# Altium schematic sheet sanziqi_v1.2.SchDoc
size A2
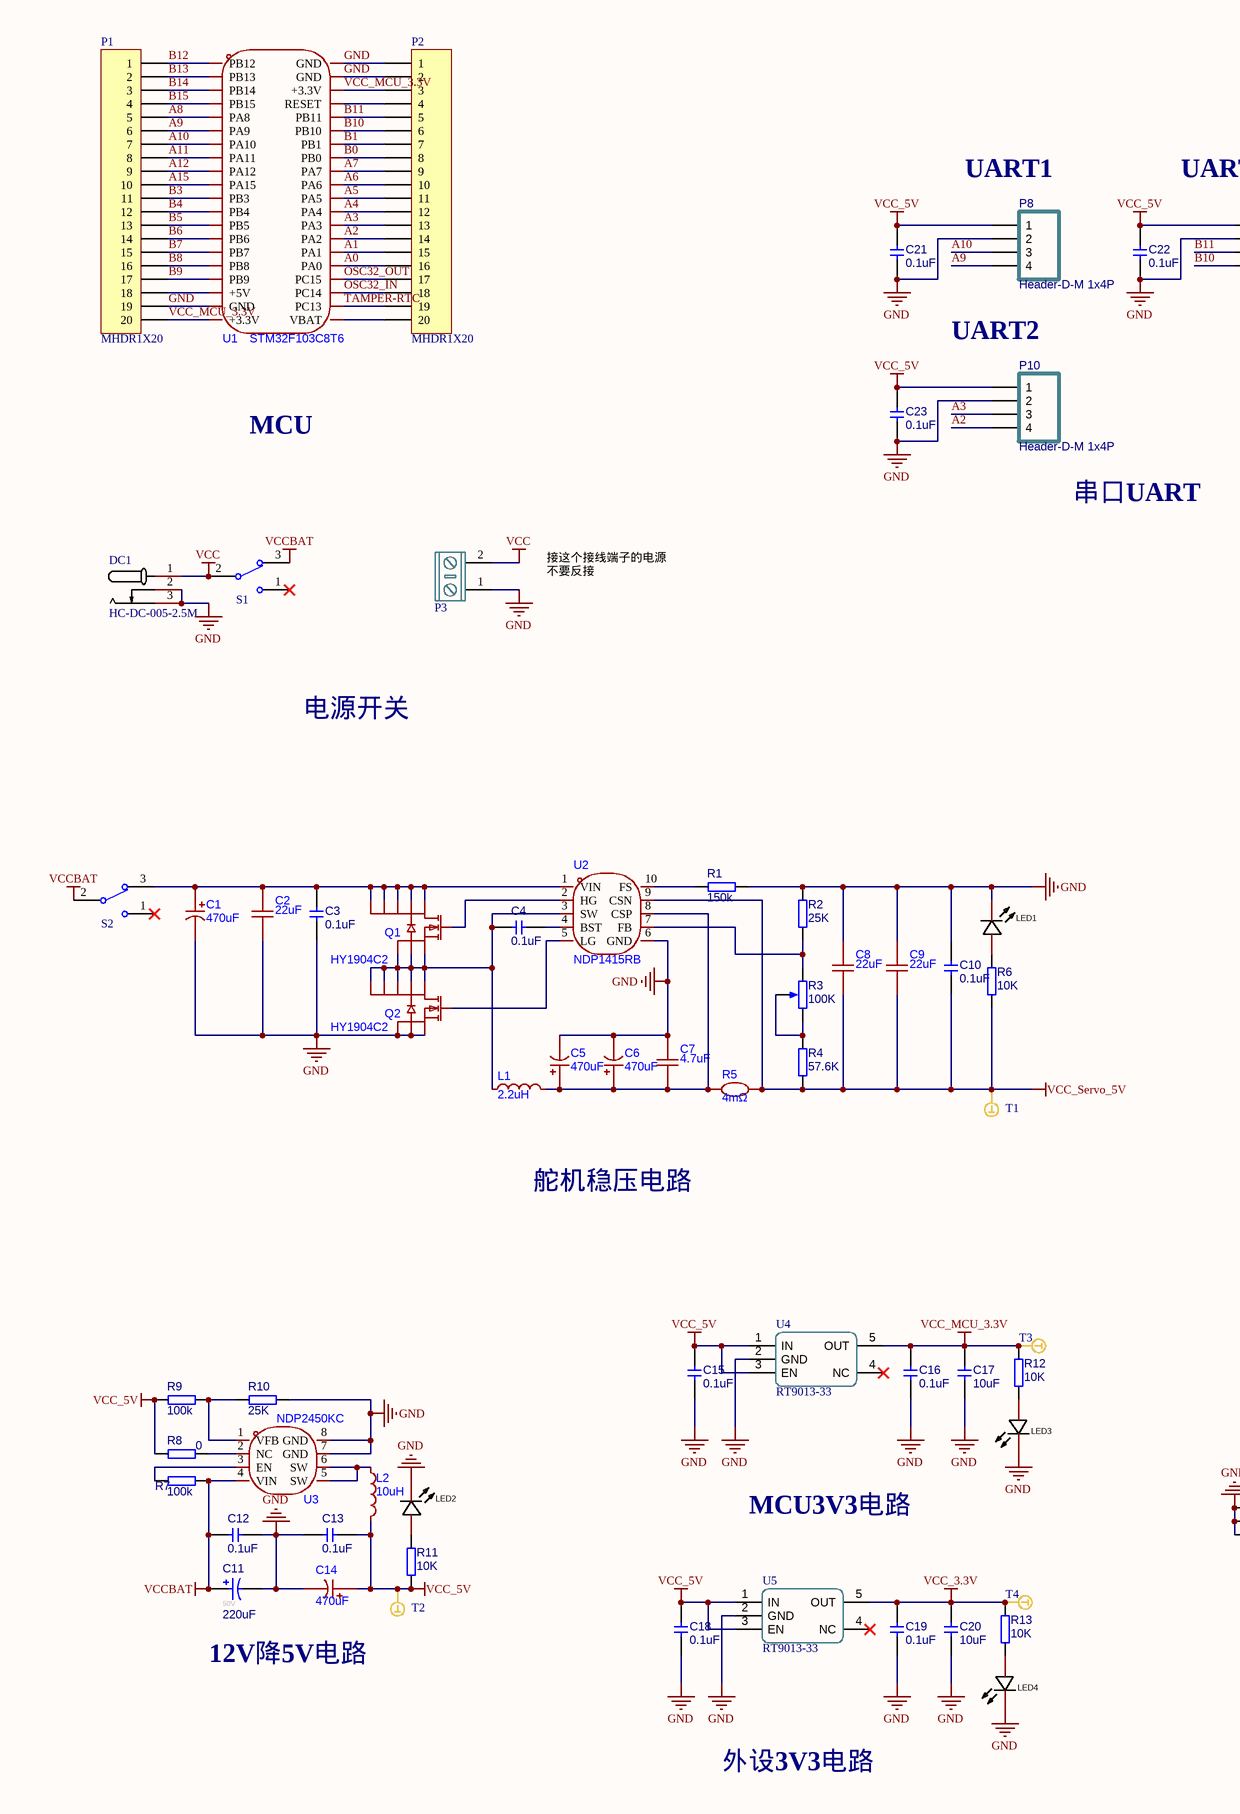
[diagram p0: sanziqi_v1.2.SchDoc, left]
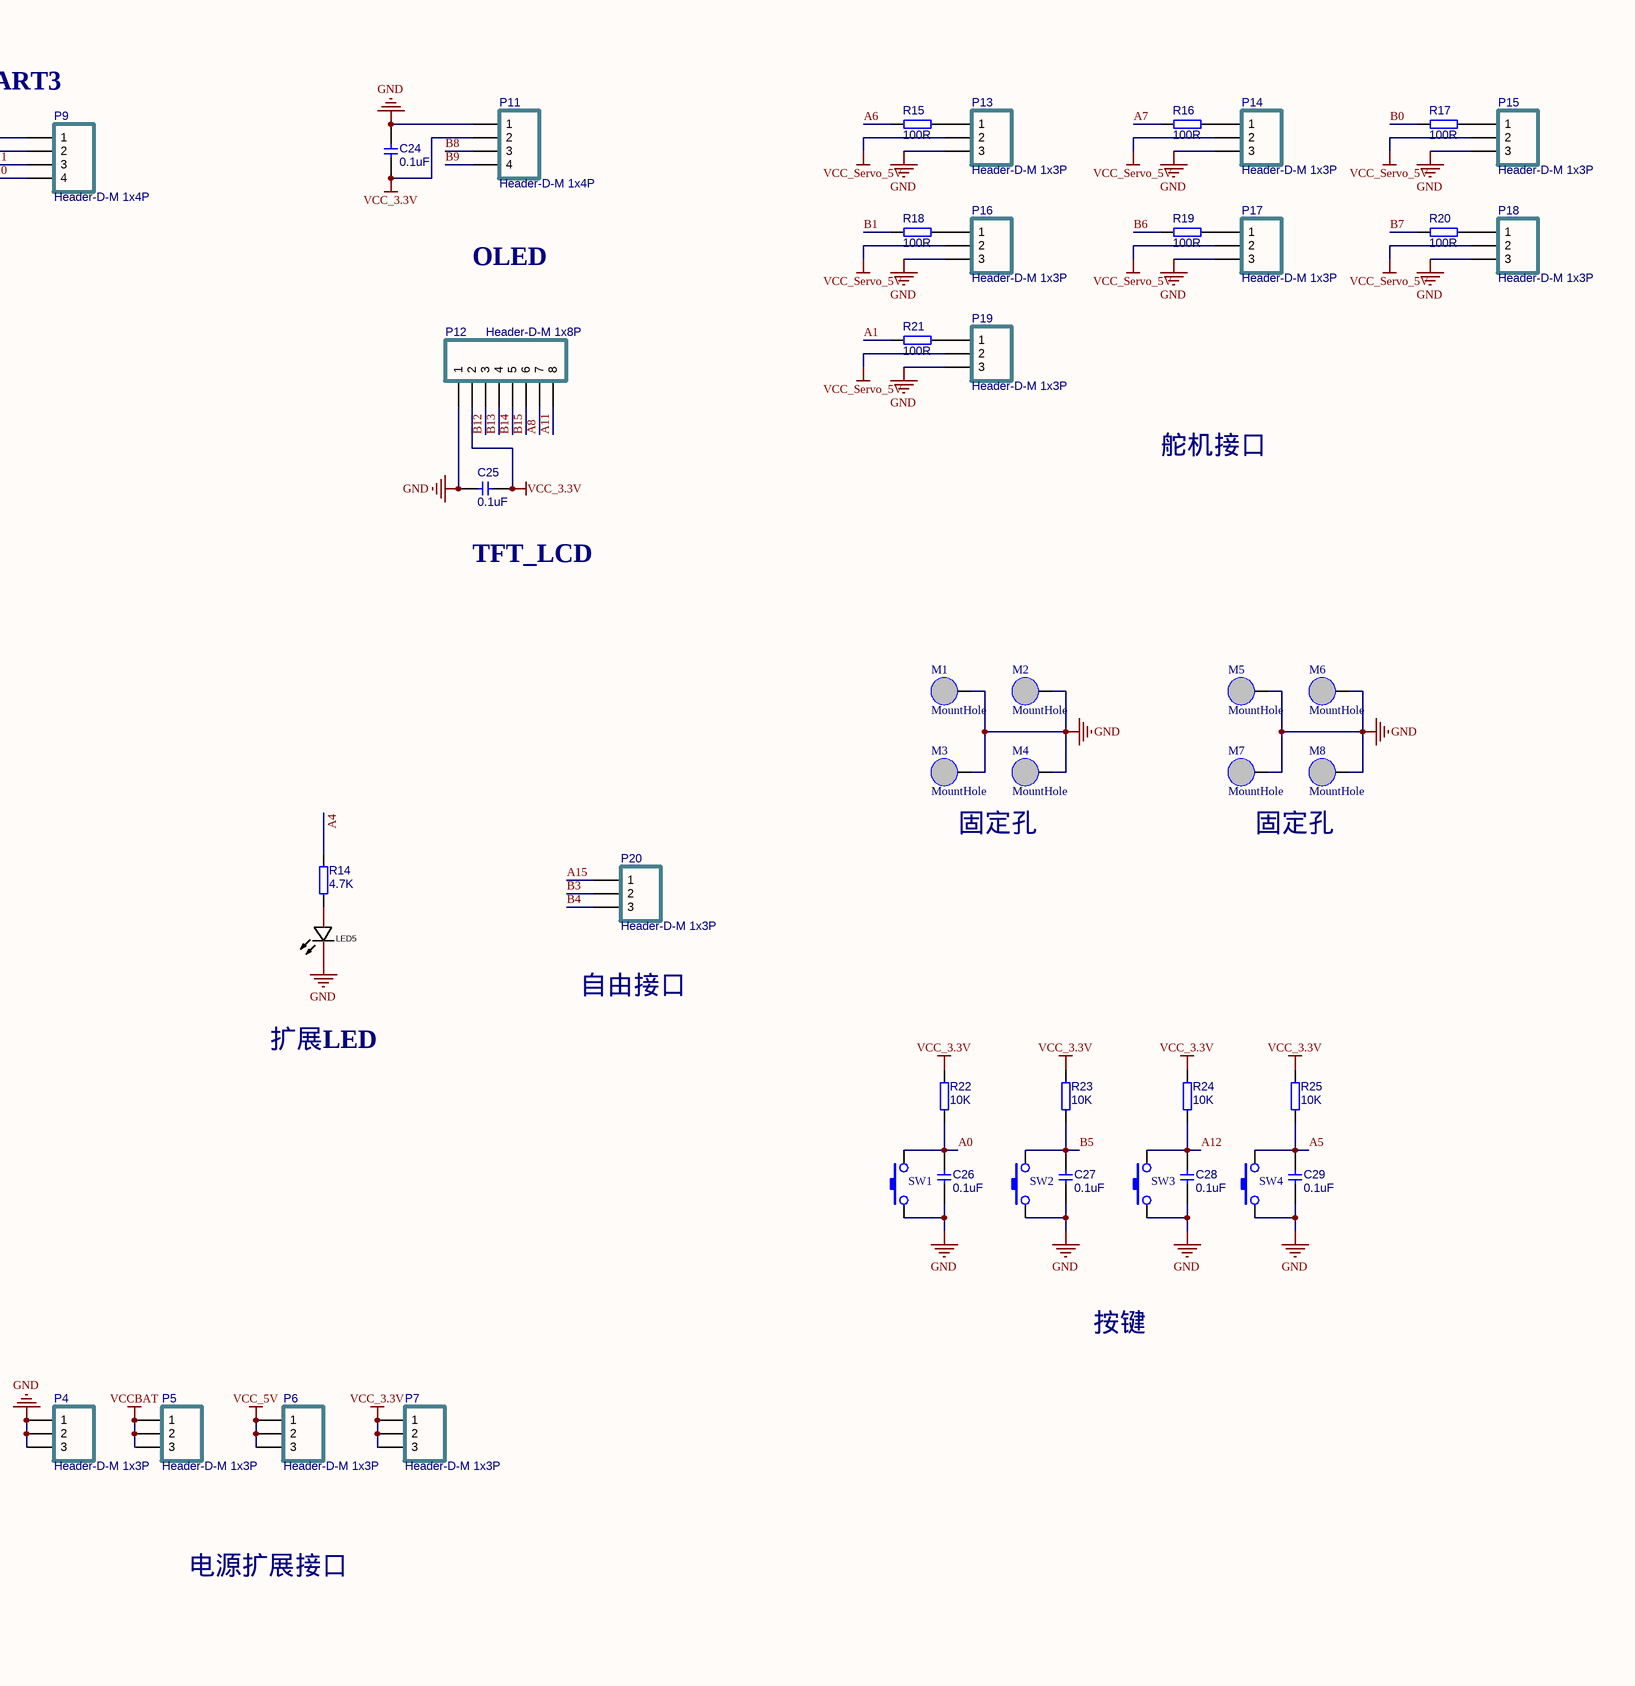
[diagram p1: sanziqi_v1.2.SchDoc, right]

## Parts
C1  470uF  [CAP-TH_BD10.0-P5.00-D0.6-FD]
C2  22uF  [C1206]
C3  value 0.1uF  [C0805]
C4  value 0.1uF  [C0805]
C5  470uF  [CAP-TH_BD10.0-P5.00-D0.6-FD]
C6  470uF  [CAP-TH_BD10.0-P5.00-D0.6-FD]
C7  4.7uF  [C1206]
C8  22uF  [C1206]
C9  22uF  [C1206]
C10  value 0.1uF  [C0805]
C11  value 220uF  Voltage: 50V  [CAP-TH_BD8.0-P3.50-D0.6-FD]  (hidden comment: 220uF 50V 铝电解)
C12  value 0.1uF  [C0805]
C13  value 0.1uF  [C0805]
C14  470uF  [CAP-TH_BD10.0-P5.00-D0.6-FD]
C15  value 0.1uF  [C0805]
C16  value 0.1uF  [C0805]
C17  value 10uF  [C0805]
C18  value 0.1uF  [C0805]
C19  value 0.1uF  [C0805]
C20  value 10uF  [C0805]
C21  value 0.1uF  [C0805]
C22  value 0.1uF  [C0805]
C23  value 0.1uF  [C0805]
C24  value 0.1uF  [C0805]
C25  value 0.1uF  [C0805]
C26  value 0.1uF  [C0805]
C27  value 0.1uF  [C0805]
C28  value 0.1uF  [C0805]
C29  value 0.1uF  [C0805]
DC1  HC-DC-005-2.5M  [DC-005]
L1  2.2uH  [IND-SMD_L11.5-W10.0_FXL1040]
L2  10uH  [IND-SMD_L11.5-W10.0_FXL1040]
LED1  NCD0805R1  [LED0805-R-RD]  (value not drawn)
LED2  NCD0805R1  [LED0805-R-RD]  (value not drawn)
LED3  NCD0805R1  [LED0805-R-RD]  (value not drawn)
LED4  NCD0805R1  [LED0805-R-RD]  (value not drawn)
LED5  NCD0805R1  [LED0805-R-RD]  (value not drawn)
M1  MountHole  [M3-MountHole]  (no BOM)
M2  MountHole  [M3-MountHole]  (no BOM)
M3  MountHole  [M3-MountHole]  (no BOM)
M4  MountHole  [M3-MountHole]  (no BOM)
M5  MountHole  [M3-MountHole]  (no BOM)
M6  MountHole  [M3-MountHole]  (no BOM)
M7  MountHole  [M3-MountHole]  (no BOM)
M8  MountHole  [M3-MountHole]  (no BOM)
P1  MHDR1X20  [HDR2.54-LI-20P]
P2  MHDR1X20  [HDR2.54-LI-20P]
P3  KF/WJ/DG 30x connecter  [KF/WJ/DG 301-2p-5.0mm]  (value not drawn)
P4  Header-D-M 1x3P  [HDR1X3-M]
P5  Header-D-M 1x3P  [HDR1X3-M]
P6  Header-D-M 1x3P  [HDR1X3-M]
P7  Header-D-M 1x3P  [HDR1X3-M]
P8  Header-D-M 1x4P  [HDR1X4-M]
P9  Header-D-M 1x4P  [HDR1X4-M]
P10  Header-D-M 1x4P  [HDR1X4-M]
P11  Header-D-M 1x4P  [HDR1X4-M]
P12  Header-D-M 1x8P  [HDR1X8-M]
P13  Header-D-M 1x3P  [HDR1X3-M]
P14  Header-D-M 1x3P  [HDR1X3-M]
P15  Header-D-M 1x3P  [HDR1X3-M]
P16  Header-D-M 1x3P  [HDR1X3-M]
P17  Header-D-M 1x3P  [HDR1X3-M]
P18  Header-D-M 1x3P  [HDR1X3-M]
P19  Header-D-M 1x3P  [HDR1X3-M]
P20  Header-D-M 1x3P  [HDR1X3-M]
Q1  HY1904C2  [DFN-8_L5.9-W5.2-P1.27-LS6.2-BL]
Q2  HY1904C2  [DFN-8_L5.9-W5.2-P1.27-LS6.2-BL]
R1  value 150k  [R0805]  (hidden comment: 150k ±1%)
R2  value 25K  [R0805]  (hidden comment: 25K ±1%)
R3  100K  [RESPOT3296W]
R4  value 57.6K  [R0805]  (hidden comment: 57.6K ±1%)
R5  4mΩ  [RES-SMD_L6.4-W3.2-R2512]
R6  value 10K  [R0805]  (hidden comment: 10K ±1%)
R7  value 100k  [R0805]  (hidden comment: 100k ±1%)
R8  value 0  [R0805]  (hidden comment: 0 ±1%)
R9  value 100k  [R0805]  (hidden comment: 100k ±1%)
R10  value 25K  [R0805]  (hidden comment: 25K ±1%)
R11  value 10K  [R0805]  (hidden comment: 10K ±1%)
R12  value 10K  [R0805]  (hidden comment: 10K ±1%)
R13  value 10K  [R0805]  (hidden comment: 10K ±1%)
R14  value 4.7K  [R0805]  (hidden comment: 4.7K ±1%)
R15  value 100R  [R0805]  (hidden comment: 100R ±1%)
R16  value 100R  [R0805]  (hidden comment: 100R ±1%)
R17  value 100R  [R0805]  (hidden comment: 100R ±1%)
R18  value 100R  [R0805]  (hidden comment: 100R ±1%)
R19  value 100R  [R0805]  (hidden comment: 100R ±1%)
R20  value 100R  [R0805]  (hidden comment: 100R ±1%)
R21  value 100R  [R0805]  (hidden comment: 100R ±1%)
R22  value 10K  [R0805]  (hidden comment: 10K ±1%)
R23  value 10K  [R0805]  (hidden comment: 10K ±1%)
R24  value 10K  [R0805]  (hidden comment: 10K ±1%)
R25  value 10K  [R0805]  (hidden comment: 10K ±1%)
S1  SW-SPDT  [SS12D10]  (value not drawn)
S2  SW-SPDT  [SS12D10]  (value not drawn)
SW1  SW-PB_V  [TSW SMD-3*6*2.5]  (value not drawn)
SW2  SW-PB_V  [TSW SMD-3*6*2.5]  (value not drawn)
SW3  SW-PB_V  [TSW SMD-3*6*2.5]  (value not drawn)
SW4  SW-PB_V  [TSW SMD-3*6*2.5]  (value not drawn)
T1  Testpoint-Pad  [testpoint-pad-1mm]  (value not drawn)  (no BOM)
T2  Testpoint-Pad  [testpoint-pad-1mm]  (value not drawn)  (no BOM)
T3  Testpoint-Pad  [testpoint-pad-1mm]  (value not drawn)  (no BOM)
T4  Testpoint-Pad  [testpoint-pad-1mm]  (value not drawn)  (no BOM)
U1  STM32F103C8T6  [CONN-TH_L53.3-W22.9_STM32F103C8T6-CARD]
U2  NDP1415RB  [SSOP-10_L4.9-W3.9-P1.00-LS6.0-BL-1]
U3  NDP2450KC  [SOP-8_L4.9-W3.9-P1.27-LS6.0-BL]
U4  RT9013-33  [SOT-23-5]
U5  RT9013-33  [SOT-23-5]

## Nets
GND: C1.2 C2.1 C3.1 C5.2 C6.2 C7.2 C8.2 C9.2 C10.2 C11.2 C12.2 C13.1 C14.2 C15.1 C16.1 C17.1 C18.1 C19.1 C20.1 C21.1 C22.1 C23.1 C24.2 C25.2 C26.1 C27.1 C28.1 C29.1 DC1.2 DC1.3 LED1.2(-) LED2.2(-) LED3.2(-) LED4.2(-) LED5.2(-) M1.1 M2.1 M3.1 M4.1 M5.1 M6.1 M7.1 M8.1 P1.19 P2.1 P2.2 P3.1 P4.1 P4.2 P4.3 P8.2 P9.2 P10.2 P11.1 P12.1 P13.3 P14.3 P15.3 P16.3 P17.3 P18.3 P19.3 Q2.1(S) Q2.2(S) Q2.3(S) R1.2 R2.2 R10.2 SW1.1 SW2.1 SW3.1 SW4.1 U1.19(GND) U1.39(GND) U1.40(GND) U2.6(GND) U3.7(GND) U3.8(GND) U4.2(GND) U5.2(GND)
VCC: DC1.1 P3.2 S1.2
VCC_3.3V: C19.2 C20.2 C24.1 C25.1 P7.1 P7.2 P7.3 P11.2 P12.2 R13.2 R22.2 R23.2 R24.2 R25.2 T4.1(T) U5.5(OUT)
VCC_5V: C13.2 C14.1 C15.2 C18.2 C21.2 C22.2 C23.2 L2.2 P6.1 P6.2 P6.3 P8.1 P9.1 P10.1 R8.1 R9.1 R11.2 T2.1(T) U4.1(IN) U4.3(EN) U5.1(IN) U5.3(EN)
VCC_MCU_3.3V: C16.2 C17.2 P1.20 P2.3 R12.2 T3.1(T) U1.20(+3.3V) U1.38(+3.3V) U4.5(OUT)
VCC_Servo_5V: C8.1 C9.1 C10.1 P13.2 P14.2 P15.2 P16.2 P17.2 P18.2 P19.2 R4.1 R5.2 R6.2 T1.1(T) U2.9(CSN)
VCCBAT: C11.1 C12.1 P5.1 P5.2 P5.3 R7.2 S1.3 S2.2 U3.4(VIN)
A0: C26.2 P2.16 R22.1 SW1.2 U1.25(PA0)
A1: P2.15 R21.1 U1.26(PA1)
A2: P2.14 P10.4 U1.27(PA2)
A3: P2.13 P10.3 U1.28(PA3)
A4: P2.12 R14.2 U1.29(PA4)
A5: C29.2 P2.11 R25.1 SW4.2 U1.30(PA5)
A6: P2.10 R15.1 U1.31(PA6)
A7: P2.9 R16.1 U1.32(PA7)
A8: P1.5 P12.7 U1.5(PA8)
A9: P1.6 P8.4 U1.6(PA9)
A10: P1.7 P8.3 U1.7(PA10)
A11: P1.8 P12.8 U1.8(PA11)
A12: C28.2 P1.9 R24.1 SW3.2 U1.9(PA12)
A15: P1.10 P20.1 U1.10(PA15)
B0: P2.8 R17.1 U1.33(PB0)
B1: P2.7 R18.1 U1.34(PB1)
B3: P1.11 P20.2 U1.11(PB3)
B4: P1.12 P20.3 U1.12(PB4)
B5: C27.2 P1.13 R23.1 SW2.2 U1.13(PB5)
B6: P1.14 R19.1 U1.14(PB6)
B7: P1.15 R20.1 U1.15(PB7)
B8: P1.16 P11.3 U1.16(PB8)
B9: P1.17 P11.4 U1.17(PB9)
B10: P2.6 P9.4 U1.35(PB10)
B11: P2.5 P9.3 U1.36(PB11)
B12: P1.1 P12.3 U1.1(PB12)
B13: P1.2 P12.4 U1.2(PB13)
B14: P1.3 P12.5 U1.3(PB14)
B15: P1.4 P12.6 U1.4(PB15)
OSC32_IN: P2.18 U1.23(PC14)
OSC32_OUT: P2.17 U1.24(PC15)
TAMPER-RTC: P2.19 U1.22(PC13)
NetC1_1: C1.1 C2.2 C3.2 Q1.5(D) Q1.6(D) Q1.7(D) Q1.8(D) Q1.9(D) S2.3 U2.1(VIN)
NetC4_1: C4.1 L1.1 Q1.1(S) Q1.2(S) Q1.3(S) Q2.5(D) Q2.6(D) Q2.7(D) Q2.8(D) Q2.9(D) U2.3(SW)
NetC4_2: C4.2 U2.4(BST)
NetC5_1: C5.1 C6.1 C7.1 L1.2 R5.1 U2.8(CSP)
NetL2_1: L2.1 U3.5(SW) U3.6(SW)
NetLED1_1: LED1.1(+) R6.1
NetLED2_1: LED2.1(+) R11.1
NetLED3_1: LED3.1(+) R12.1
NetLED4_1: LED4.1(+) R13.1
NetLED5_1: LED5.1(+) R14.1
NetP1_18: P1.18 U1.18(+5V)
NetP2_4: P2.4 U1.37(RESET)
NetP2_20: P2.20 U1.21(VBAT)
NetP13_1: P13.1 R15.2
NetP14_1: P14.1 R16.2
NetP15_1: P15.1 R17.2
NetP16_1: P16.1 R18.2
NetP17_1: P17.1 R19.2
NetP18_1: P18.1 R20.2
NetP19_1: P19.1 R21.2
NetQ1_4: Q1.4(G) U2.2(HG)
NetQ2_4: Q2.4(G) U2.5(LG)
NetR1_1: R1.1 U2.10(FS)
NetR2_1: R2.1 R3.1(TOP) U2.7(FB)
NetR3_2: R3.2(BOT) R3.ADJ R4.2
NetR7_1: R7.1 U3.3(EN)
NetR8_2: R8.2 U3.2(NC)
NetR9_2: R9.2 R10.1 U3.1(VFB)

Not connected (* = marked no-connect by the designer): S1 1*; S2 1*; U4 4(NC)*; U5 4(NC)*

## Notes on the sheet
- (near P8) UART1
- (near P9) UART3
- UART2
- OLED
- MCU
- 串口UART
- 舵机接口
- 接这个接线端子的电源不要反接
- (near C25) TFT_LCD
- 电源开关
- 固定孔
- 自由接口
- 扩展LED
- 舵机稳压电路
- 按键
- MCU3V3电路
- 12V降5V电路
- 电源扩展接口
- 外设3V3电路

## Library data of the parts
C1 C5 C6 C14 = HG1H477M1016PC: 直插固态电容 470UF; Manufacturer: HONOR(荣誉); Add into BOM: yes; Tolerance: ±20%; Rated Voltage: 50V; Ripple Current: 3.15A; Equivalent Series Resistance(ESR): 32mΩ; φD: 10mm; L: 16mm; Lifetime @ Temp: 2000hrs@105℃; Symbol: HG1H477M1016PC; Device: HG1H477M1016PC; LCSC Part Name: 470uF ±20% 50V; Supplier Part: C5438877; Manufacturer Part: HG1H477M1016PC; Supplier Footprint: 插件,D10xL16mm; JLCPCB Part Class: Extended Part; Datasheet: https://atta.szlcsc.com/upload/public/pdf/source/20230323/E6B46A248FBB182638B68380B3289E6D.pdf; Supplier: LCSC; Convert to PCB: yes; Value: 470uF; Lead Spacing: 5mm; Operating Temperature: -55℃~+105℃
C2 C8 C9 = Cap 22uF 1206: Manufacturer: HRE(芯声); Symbol: CGA1206X5R226M350NT; Add into BOM: yes; Tolerance: ±20%; Voltage Rated: 35V; Temperature Coefficient: X5R; Device: CGA1206X5R226M350NT; LCSC Part Name: 22uF ±20% 35V; Supplier Part: C6119969; Manufacturer Part: CGA1206X5R226M350NT; Supplier Footprint: 1206; JLCPCB Part Class: Extended Part; Supplier: LCSC; Convert to PCB: yes; Value: 22uF
C3 C4 C10 C15 C16 C18 C19 C21-C29 = Cap 0.1uF 0805: 贴片电容0805; Revision: V1.0
C7 = Cap 22uF 1206: Manufacturer: HRE(芯声); Symbol: CGA1206X5R226M350NT; Add into BOM: yes; Value: 22uF; Tolerance: ±20%; Voltage Rated: 35V; Temperature Coefficient: X5R; Device: CGA1206X5R226M350NT; LCSC Part Name: 22uF ±20% 35V; Supplier Part: C6119969; Manufacturer Part: CGA1206X5R226M350NT; Supplier Footprint: 1206; JLCPCB Part Class: Extended Part; Supplier: LCSC; Convert to PCB: yes
C11 = 220uF 50V : 直插电解电容 220uF; Revision: V1.0; Type: 铝电解
C12 C13 = 0.1uF 0805: 贴片电容0805; Revision: V1.0
C17 C20 = Cap 10uF 0805: 贴片电容0805; Revision: V1.0
DC1 = HC-DC-005-2.5M: Manufacturer: HCTL(华灿天禄); 3DModel: DC-IN-TH_KH-DC-005-2.5; Add into BOM: yes; Symbol: HC-DC-005-2.5M; Device: HC-DC-005-2.5M; link: https://atta.szlcsc.com/upload/public/pdf/source/20210716/C2847170_7F0110A0BEDEE81C68B76DF87AC8DA16.pdf; Supplier: LCSC; Supplier Part: C3010535; Manufacturer Part: HC-DC-005-2.5M; JLCPCB Part Class: ExtendedPart; Convert to PCB: yes; Origin Footprint: DC-IN-TH_KH-DC-005-2.5; Name: HC-DC-005-2.5M
L1 = FXL1050-2R2-M: Manufacturer: cjiang(长江微电); Add into BOM: yes; Tolerance: ±20%; Rated Current: 15A; Saturation Current (Isat): 19A; DC Resistance (DCR): 6mΩ; Type: 一体成型电感; Symbol: FXL1050-2R2-M; Device: FXL1050-2R2-M; LCSC Part Name: 2.2uH ±20% 19A; Supplier Part: C5359259; Manufacturer Part: FXL1050-2R2-M; Supplier Footprint: SMD,10x11.5mm; JLCPCB Part Class: Extended Part; Datasheet: https://atta.szlcsc.com/upload/public/pdf/source/20240426/3189EA8206330E2108542F9E34E540E7.pdf; Supplier: LCSC; Convert to PCB: yes; Value: 2.2uH
L2 = FXL1040-100-M: Manufacturer: cjiang(长江微电); Add into BOM: yes; Tolerance: ±20%; Rated Current: 7.8A; Current - Saturation (Isat): 8.5A; DC Resistance (DCR): 30mΩ; Type: 一体成型电感; Symbol: FXL1040-100-M; Device: FXL1040-100-M; LCSC Part Name: 10uH ±20% 8.5A; Supplier Part: C475915; Manufacturer Part: FXL1040-100-M; Supplier Footprint: SMD,11.5x10mm; JLCPCB Part Class: Extended Part; Datasheet: https://atta.szlcsc.com/upload/public/pdf/source/20240426/3189EA8206330E2108542F9E34E540E7.pdf; Supplier: LCSC; Convert to PCB: yes; Value: 10uH
LED1-LED5 = LED: Manufacturer: 国星光电; Symbol: FC-2012HRK-620D; Add into BOM: yes; Emitted Color: 红色; Forward Voltage (VF): 1.6V~2.6V; Power Dissipation: 65mW; Forward Current: 20mA; Dominant Wavelength: 615nm~630nm; Diode Configuration: 独立二极管; Lens Color: 无色透明; Luminous Intensity: 67mcd~195mcd; Viewing Angle: 130°; Device: NCD0805R1; Supplier: LCSC; Manufacturer Part: NCD0805R1; Supplier Part: C84256; JLCPCB Part Class: Basic Part; LCSC Part Name: NCD0805R1; Supplier Footprint: 0805; Datasheet: https://atta.szlcsc.com/upload/public/pdf/source/20200820/C84256_F0A75A43B3EAD75808600A0514C76B99.pdf; Convert to PCB: yes; Lamp Holder Type: -; Peak Wavelength: -; Color Temperature: -; Mounting Sytle: -; Operating Temperature: -30℃~+85℃
M1-M8 = MountHole: 固定孔
P1 P2 = MHDR1X20: Header, 20-Pin; LatestRevisionDate: 17-Jul-2002; LatestRevisionNote: Re-released for DXP Platform.; Publisher: Altium Limited
P3 = KF/WJ/DG 30x: 接线端子 2Pin
P4-P7 P13-P20 = Header-D-M 1x3P: 1x3pin, 直插, 排针; Revision: V1.0; Value: Header-D-M 1x3P
P8-P11 = Header-D-M 1x4P: 1x4pin, 直插, 排针; Revision: V1.0; Value: Header-D-M 1x4P
P12 = Header-D-M 1x8P: 1x8pin, 直插, 排针; Revision: V1.0; Value: Header-D-M 1x8P
Q1 Q2 = HY1904C2: Manufacturer: HUAYI(华羿微); Add into BOM: yes; Type: 1个N沟道; Drain Source Voltage (Vdss): 40V; Continuous Drain Current (Id): 65A; Drain Source On Resistance (RDS(on)@Vgs,Id): 5.1mΩ@10V,20A; Power Dissipation (Pd): 48W; Gate Threshold Voltage (Vgs(th)@Id): 1.7V@250uA; Input Capacitance (Ciss@Vds): 2.391nF; Reverse Transfer Capacitance (Crss@Vds): 195pF; Symbol: HY1904C2; Device: HY1904C2; LCSC Part Name: 1个N沟道 耐压:40V 电流:65A; Supplier Part: C358116; Manufacturer Part: HY1904C2; Supplier Footprint: PPAK-8L(5x6); JLCPCB Part Class: Extended Part; Datasheet: https://atta.szlcsc.com/upload/public/pdf/source/20240403/459DCB52747AD59BD0F26F373CF55DC0.pdf; Supplier: LCSC; Convert to PCB: yes; Operating Temperature: -55℃~+150℃
R1 = Res-Chip-150K: 贴片电阻; Power: 1/8W; Revision: V1.0; Tolerance: ±1%
R2 R10 = Res-Chip-25K: 贴片电阻; Power: 1/8W; Revision: V1.0; Tolerance: ±1%
R3 = Res-Adj-3p: 可调电阻; Value: 100K
R4 = Res-Chip-57.6K: 贴片电阻; Power: 1/8W; Revision: V1.0; Tolerance: ±1%
R5 = Res-Chip-4mR-2512-3W: Manufacturer: Milliohm(毫欧); Symbol: HOJLR2512-3W-4MR-1%; Add into BOM: yes; Tolerance: ±1%; Power(Watts): 3W; Mounting Sytle: 贴片; Device: HoJLR2512-3W-4mR-1%; LCSC Part Name: 4mΩ ±1% 3W; Supplier Part: C2904236; Manufacturer Part: HoJLR2512-3W-4mR-1%; Supplier Footprint: 2512; JLCPCB Part Class: Extended Part; Datasheet: https://atta.szlcsc.com/upload/public/pdf/source/20211009/7525CABAB363C979E942C1DD41F1FEF0.pdf; Supplier: LCSC; Convert to PCB: yes; Type: 采样电阻; Value: 4mΩ
R6 R11-R14 = Res-Chip-4.7K: 贴片电阻; Power: 1/8W; Revision: V1.0; Tolerance: ±1%
R7 R9 = Res-Chip-100K: 贴片电阻; Power: 1/8W; Revision: V1.0; Tolerance: ±1%
R8 = Res-Chip-0: 贴片电阻; Power: 1/8W; Revision: V1.0; Tolerance: ±1%
R15-R21 = Res-Chip-100R: 贴片电阻; Power: 1/8W; Revision: V1.0; Tolerance: ±1%
R22-R25 = Res-Chip-10K: 贴片电阻; Power: 1/8W; Revision: V1.0; Tolerance: ±1%
S1 S2 = SW-SPDT: 单刀双掷开关 3脚船型、钮子、拨动开关 SPDT Subminiature Toggle Switch; Published: 24-Mar-1999; Publisher: Altium Limited; Price(RMB): 0.000
SW1-SW4 = SW-PB_V: SWITCH
T1-T4 = Testpoint-Pad-S: 测试点，就是个焊盘
U1 = STM32F103C8T6: Manufacturer: 立创开发板; Symbol: LCKFB-DKX-STM32F103C8T6; Add into BOM: yes; Device: LCKFB-DKX-STM32F103C8T6; LCSC Part Name: 立创·地阔星-STM32F103C8T6开发板; Supplier Part: C22396880; Manufacturer Part: LCKFB-DKX-STM32F103C8T6; Supplier Footprint: -; JLCPCB Part Class: Extended Part; Datasheet: https://atta.szlcsc.com/upload/public/pdf/source/20240801/7EEF69F7480DF7C6DA98696664D658D4.pdf; Supplier: LCSC; Convert to PCB: yes
U2 = NDP1415RB: Manufacturer: NDP(芯潭微); Add into BOM: yes; Function: 降压型; Input Voltage: 7V~28V; Output Current: 20A; Switching Frequency: 300kHz; Synchronous Rectification: 是; Number of Outputs: 1; Topology: 降压式; Switch tube (built-in/external): 外置; Symbol: NDP1415RB; Device: NDP1415RB; LCSC Part Name: 高效同步降压DC/DC控制器; Supplier Part: C7420579; Manufacturer Part: NDP1415RB; Supplier Footprint: SSOP-10; JLCPCB Part Class: Extended Part; Datasheet: https://atta.szlcsc.com/upload/public/pdf/source/20241223/4836769600561BB75D4AE5E87B409A49.pdf; Supplier: LCSC; Convert to PCB: yes; Operating Temperature: -40℃~+150℃
U3 = NDP2450KC: Manufacturer: NDP(芯潭微); Add into BOM: yes; Function: 降压型; Output Type: 可调; Input Voltage: 5.5V~40V; Output Current: 5A; Switching Frequency: 300kHz; Number of Outputs: 1; Topology: 降压式; Quiescent Current (Iq): 1.3mA; Switch tube (built-in/external): 内置; Symbol: NDP2450KC; Device: NDP2450KC; LCSC Part Name: 高效同步降压DC/DC转换器; Supplier Part: C7420594; Manufacturer Part: NDP2450KC; Supplier Footprint: SOP-8; JLCPCB Part Class: Extended Part; Datasheet: https://atta.szlcsc.com/upload/public/pdf/source/20241223/8636749DAA6B1A5E6731A1AFEB5B6D25.pdf; Supplier: LCSC; Convert to PCB: yes; Output Voltage: -; Operating Temperature: -40℃~+150℃; Synchronous Rectification: -
U4 U5 = RT9013-33: 3.3V 500mA SOT-23-5 LDO